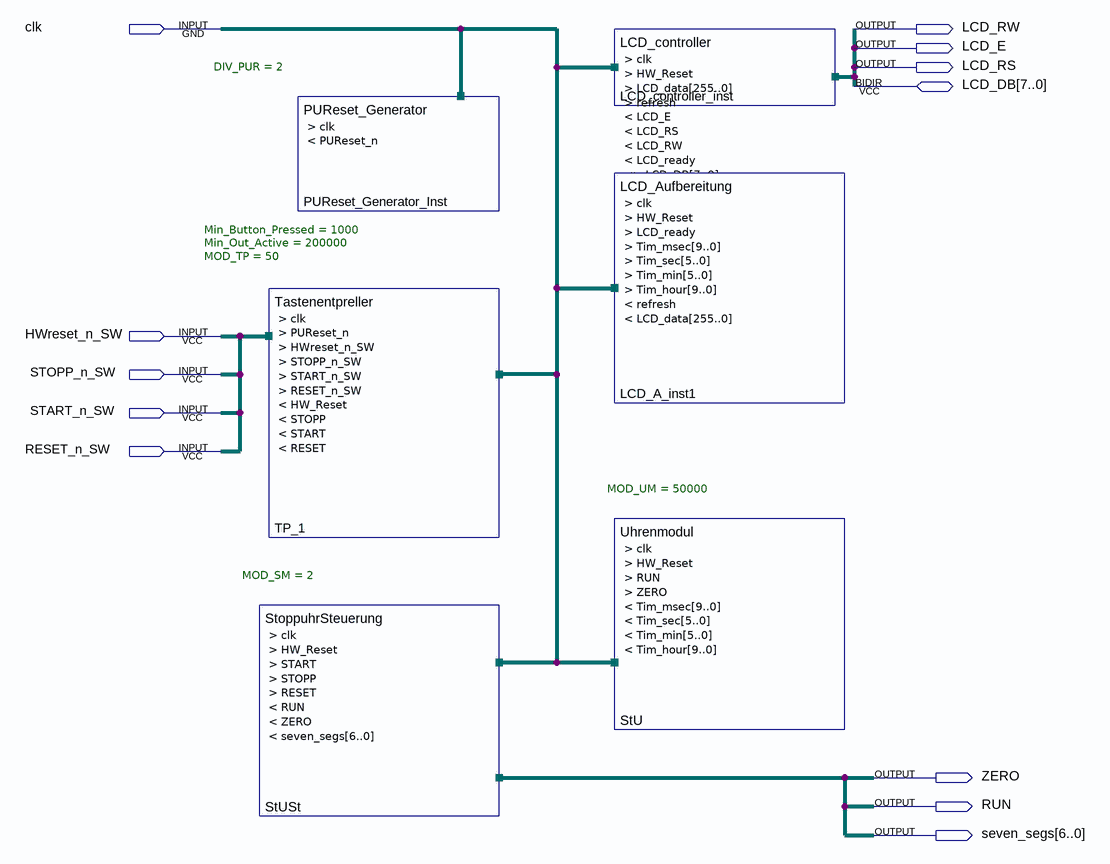
[diagram p0: schematic sheet]
// Quartus schematic CA2_SM_S.bdf as structural Verilog: 6 symbols, 12 pins
module CA2_SM_S (
  input  clk,
  input  HWreset_n_SW,
  input  STOPP_n_SW,
  input  START_n_SW,
  input  RESET_n_SW,
  inout  [7:0] LCD_DB,
  output LCD_RW,
  output LCD_E,
  output LCD_RS,
  output ZERO,
  output RUN,
  output [6:0] seven_segs
);

  wire HW_Reset, LCD_ready, PUReset_n, refresh, RESET, START, STOPP;
  wire [5:0] Tim_min, Tim_sec;
  wire [9:0] Tim_hour, Tim_msec;
  wire [255:0] LCD_data;

  PUReset_Generator #(.DIV_PUR(2)) PUReset_Generator_Inst (.clk(clk), .PUReset_n(PUReset_n));
  Tastenentpreller #(.Min_Button_Pressed(1000), .Min_Out_Active(200000), .MOD_TP(50)) TP_1 (
    .clk(clk), .PUReset_n(PUReset_n), .HWreset_n_SW(HWreset_n_SW), .STOPP_n_SW(STOPP_n_SW),
    .START_n_SW(START_n_SW), .RESET_n_SW(RESET_n_SW), .HW_Reset(HW_Reset), .STOPP(STOPP), .START(START),
    .RESET(RESET));
  StoppuhrSteuerung #(.MOD_SM(2)) StUSt (
    .clk(clk), .HW_Reset(HW_Reset), .START(START), .STOPP(STOPP), .RESET(RESET), .RUN(RUN), .ZERO(ZERO),
    .seven_segs(seven_segs));
  LCD_controller LCD_controller_inst (
    .clk(clk), .HW_Reset(HW_Reset), .LCD_data(LCD_data), .refresh(refresh), .LCD_E(LCD_E), .LCD_RS(LCD_RS),
    .LCD_RW(LCD_RW), .LCD_ready(LCD_ready), .LCD_DB(LCD_DB));
  LCD_Aufbereitung LCD_A_inst1 (
    .clk(clk), .HW_Reset(HW_Reset), .LCD_ready(LCD_ready), .Tim_msec(Tim_msec), .Tim_sec(Tim_sec),
    .Tim_min(Tim_min), .Tim_hour(Tim_hour), .refresh(refresh), .LCD_data(LCD_data));
  Uhrenmodul #(.MOD_UM(50000)) StU (
    .clk(clk), .HW_Reset(HW_Reset), .RUN(RUN), .ZERO(ZERO), .Tim_msec(Tim_msec), .Tim_sec(Tim_sec),
    .Tim_min(Tim_min), .Tim_hour(Tim_hour));
endmodule
